# EAGLE design Puzzle Relay 10A v1.0 (EAGLE 6.2)
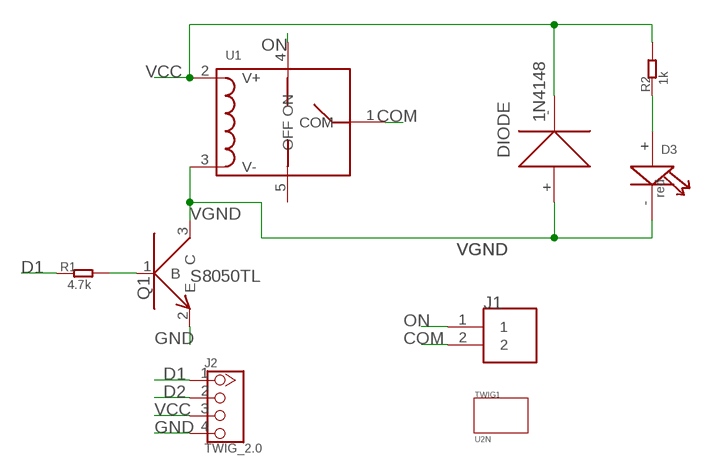
[diagram p0: schematic, sheet 1]

## Parts
D3  red  LED0805  [LED0805]
DIODE  1N4148  DIODE1206  [DIODE1206]
J1  CON2  [CON2]
J2  TWIG_2.0  [2.0_1X4]
Q1  NPN_9013  [SOT23]
R1  4.7k  R0603  [0603]
R2  1k  R0603  [0603]
TWIG1  U2N  [U2N]
U1  RELAY  [RELAY]

## Nets
COM: J1.2 U1.1(COM)
D1: J2.1 R1.1
D2: J2.2
GND: J2.4 Q1.2(E)
N$1: D3.+ R2.1
N$2: Q1.1(B) R1.2
ON: J1.1 U1.4(ON)
VCC: DIODE.- J2.3 R2.2 U1.2(V+)
VGND: D3.- DIODE.+ Q1.3(C) U1.3(V-)
Unconnected: U1.5(OFF)

## Notes on the sheet
- S8050TL

## Library data of the parts
D3 = CPT_SMD:LED0805
DIODE = CPT_SMD:DIODE
J1 = seeedleo:CON2
J2 = CONNECTER:TWIG_2.0
Q1 = CPT_SMD:NPN_9013
R1 R2 = CPT_SMD:R0603
TWIG1 = twig_template1:U2N
U1 = Seeed:RELAY

## Board
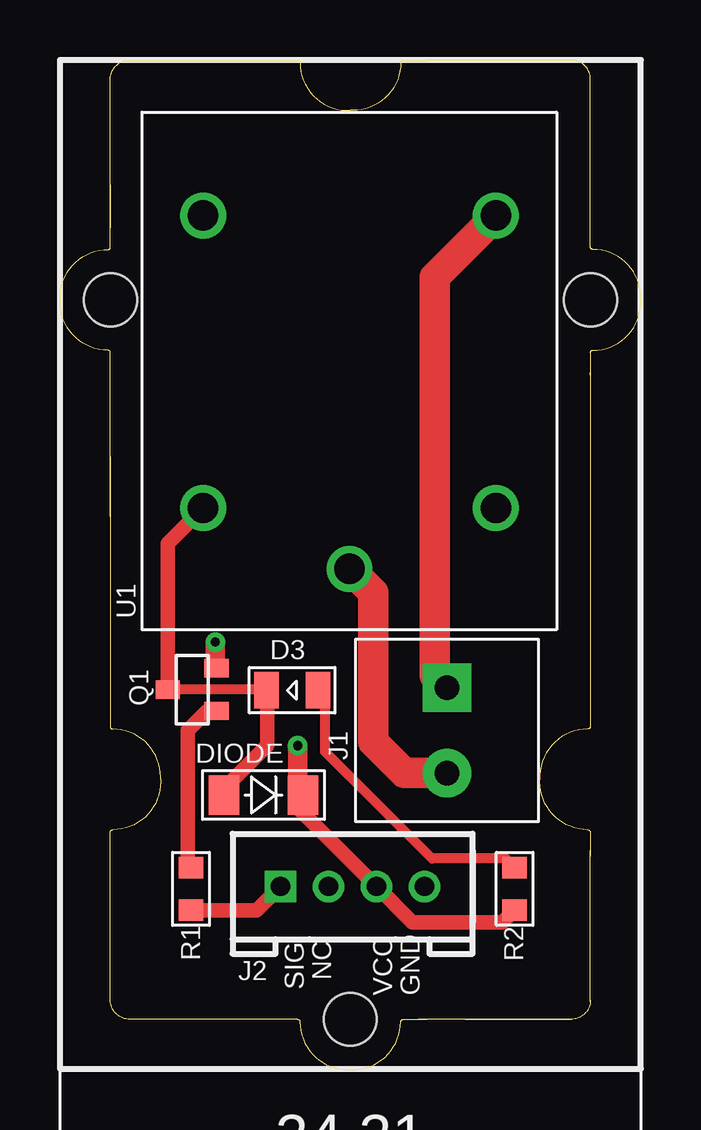
[diagram p1: board, top side]
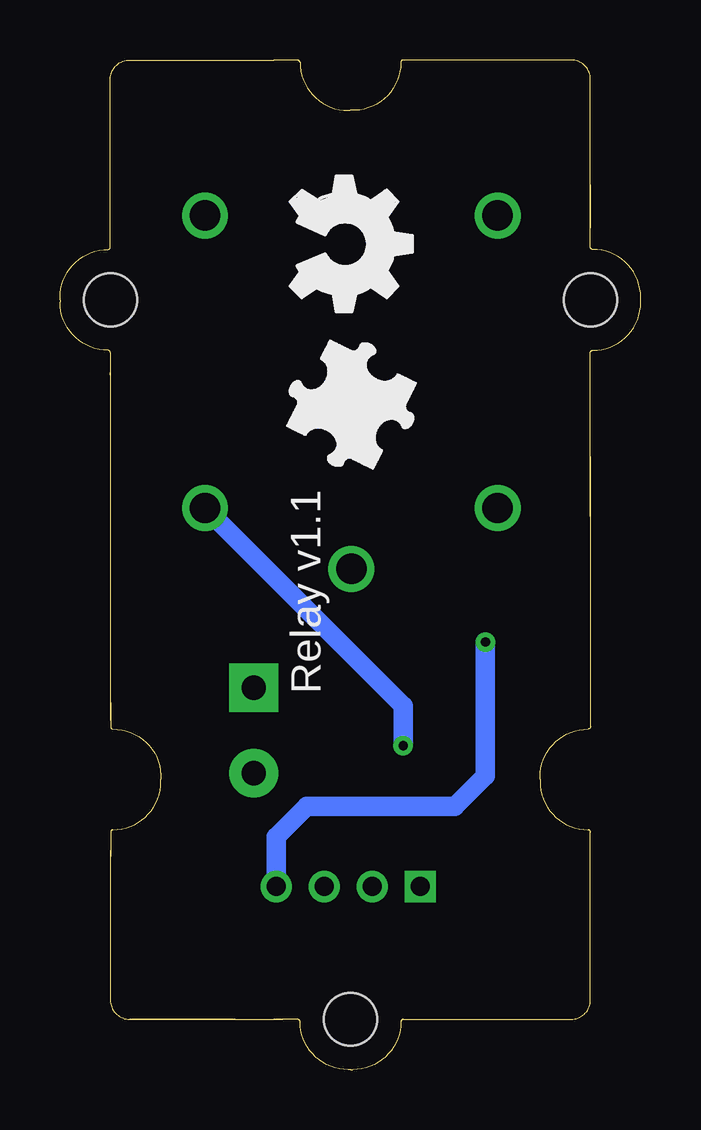
[diagram p2: board, bottom side, seen from below]

Size 24.2 x 42.09 mm. Coordinates in mm from the lower left corner, seen from the top.
Copper layers (1*16): Top 0.035mm / dielectric 1.5mm / Bottom 0.035mm
Design rules "default": minimum track width 6mil, minimum drill 12mil, track to track 6mil, track to pad 6mil, pad to pad 6mil, via to via 6mil, smd to smd 0mil, copper to edge 10mil, drill to drill 10mil, minimum pad ring 10mil, minimum via ring 6mil, stop-mask expansion 2mil, vias tented up to drill 100mil, thermal gap 10mil

### Footprints (pad centres in the part's own frame; a part is rotated, then mirrored left to right if it is on the bottom)
LED0805 = smd 1.016 x 1.524: + -1.077,0; - 1.077,0
DIODE1206 = smd 1.27 x 1.651: + -1.651,0; - 1.651,0
CON2 = drill 1.016 pad 2.032 square: 1 0,1.778 | drill 1.016 pad 2.032: 2 0,-1.778
2.0_1X4 = drill 0.8 pad 1.27 square: 1 -3,0 | drill 0.8 pad 1.27: 2 -1,0; 3 1,0; 4 3,0
SOT23 = smd 0.762 x 1.016: 1 -0.889,-1.016; 2 0.889,-1.016; 3 0,1.016
0603 = smd 0.889 x 1.016: 1 -0.889,0; 2 0.889,0
U2N = hole 2.2: 10.453,-10.42; 10.453,9.58; -19.535,-0.415
RELAY = drill 1.27: 1 -2.54,-6.096; 2 0,-12.192; 3 0,0; 4 12.192,-12.192; 5 12.192,0

### Placement (x,y rotation side)
D3  9.67,15.82 180 top
DIODE  8.48,11.45 0 top
J1  16.12,14.14 0 top
J2  12.19,7.64 0 top
Q1  5.51,15.84 90 top
R1  5.46,7.54 90 top
R2  18.94,7.54 270 top
TWIG1  11.68,21.64 90 top
U1  5.97,23.41 90 top
U$2  [OSHW_FILLX200_NOTEXT]  14.6,37.26 270 bottom
U$3  [BRICK-LOGO-2-B-MIL-0.6]  15.11,24.68 90 top

### Tracks (layer width: path | path; a pad name or v marks a point on that pad's centre or on a via)
COM
  Top 1.27: J1.2 14.35,12.36 13.05,13.66 13.05,19.88 U1.1
D1
  Top 0.61: R1.1 8.2,6.65 J2.1
GND  (via drill 0.38 pad 0.81)
  Top 0.406: 6.47,16.68 Q1.2 6.47,16.78 6.47,16.81
  Top 0.813: v6.47,17.83 6.47,16.81
  Bottom 0.813: J2.4 15.19,9.7 13.92,10.97 7.74,10.97 6.47,12.24 v6.47,17.83
N$1
  Top 0.406: D3.+ 10.75,15.33 10.93,15.33 11.04,15.44 11.04,13.25 15.49,8.81 18.56,8.81 R2.1
N$2
  Top 0.61: Q1.1 6.14,14.96 5.33,14.14 5.33,8.55 R1.2
ON
  Top 1.27: U1.4 18.16,35.58 15.62,33.04 15.62,16.43 J1.1
VCC  (via drill 0.38 pad 0.81)
  Top 0.61: R2.2 18.44,6.14 14.69,6.14 J2.3 9.93,10.89 9.93,11.25 DIODE.-
  Top 0.813: v9.9,13.51 9.9,11.45 DIODE.-
  Bottom 0.813: v9.9,13.51 9.9,15.16 U1.2
VGND
  Top 0.305: D3.- 8.57,15.84
  Top 0.406: 8.57,15.84 Q1.3
  Top 0.61: Q1.3 4.49,21.94 U1.3 | DIODE.+ 6.83,11.7 8.63,13.51 8.63,15.78 D3.-

### Text on the board
tPlace: NC | SIG | VCC | GND
bPlace: Relay v1.1